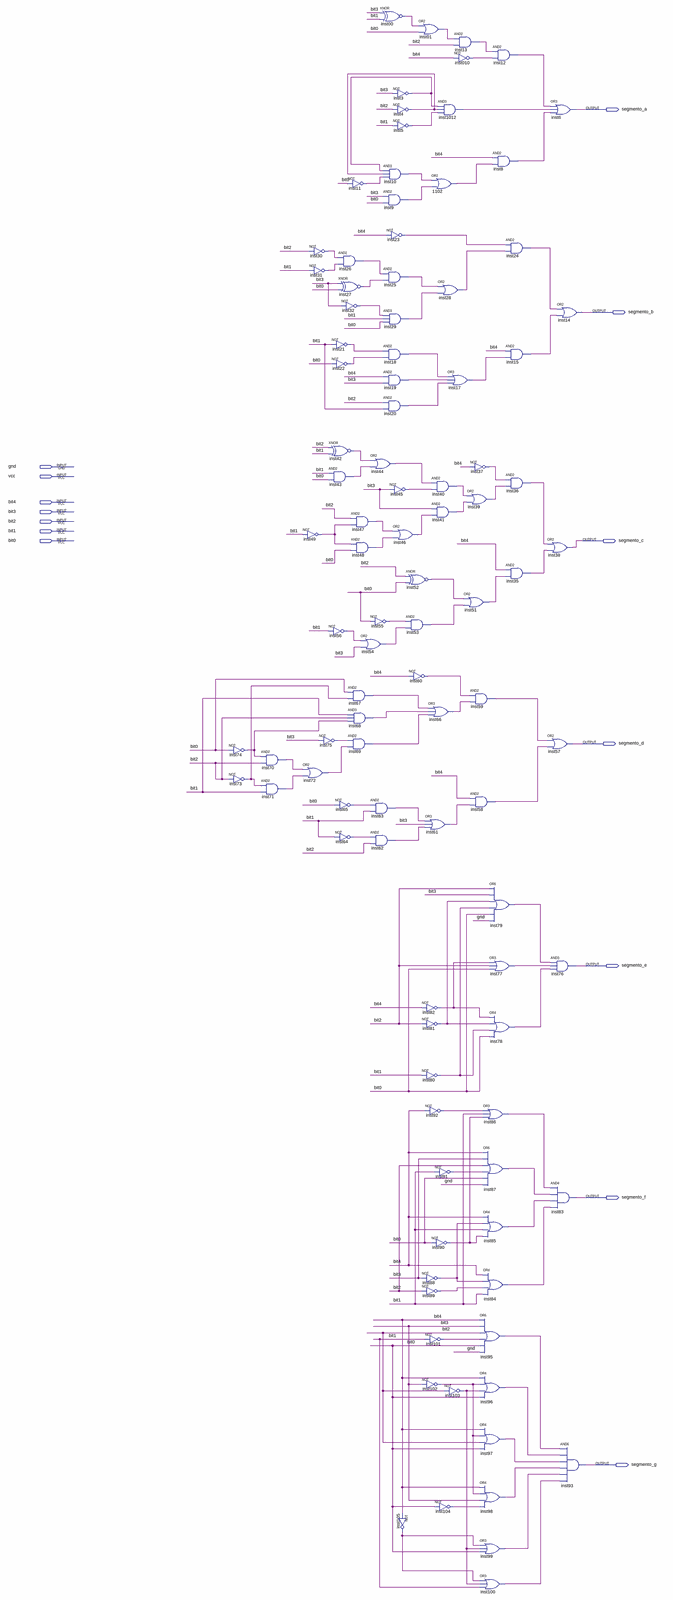
[diagram p0: schematic sheet, whole]
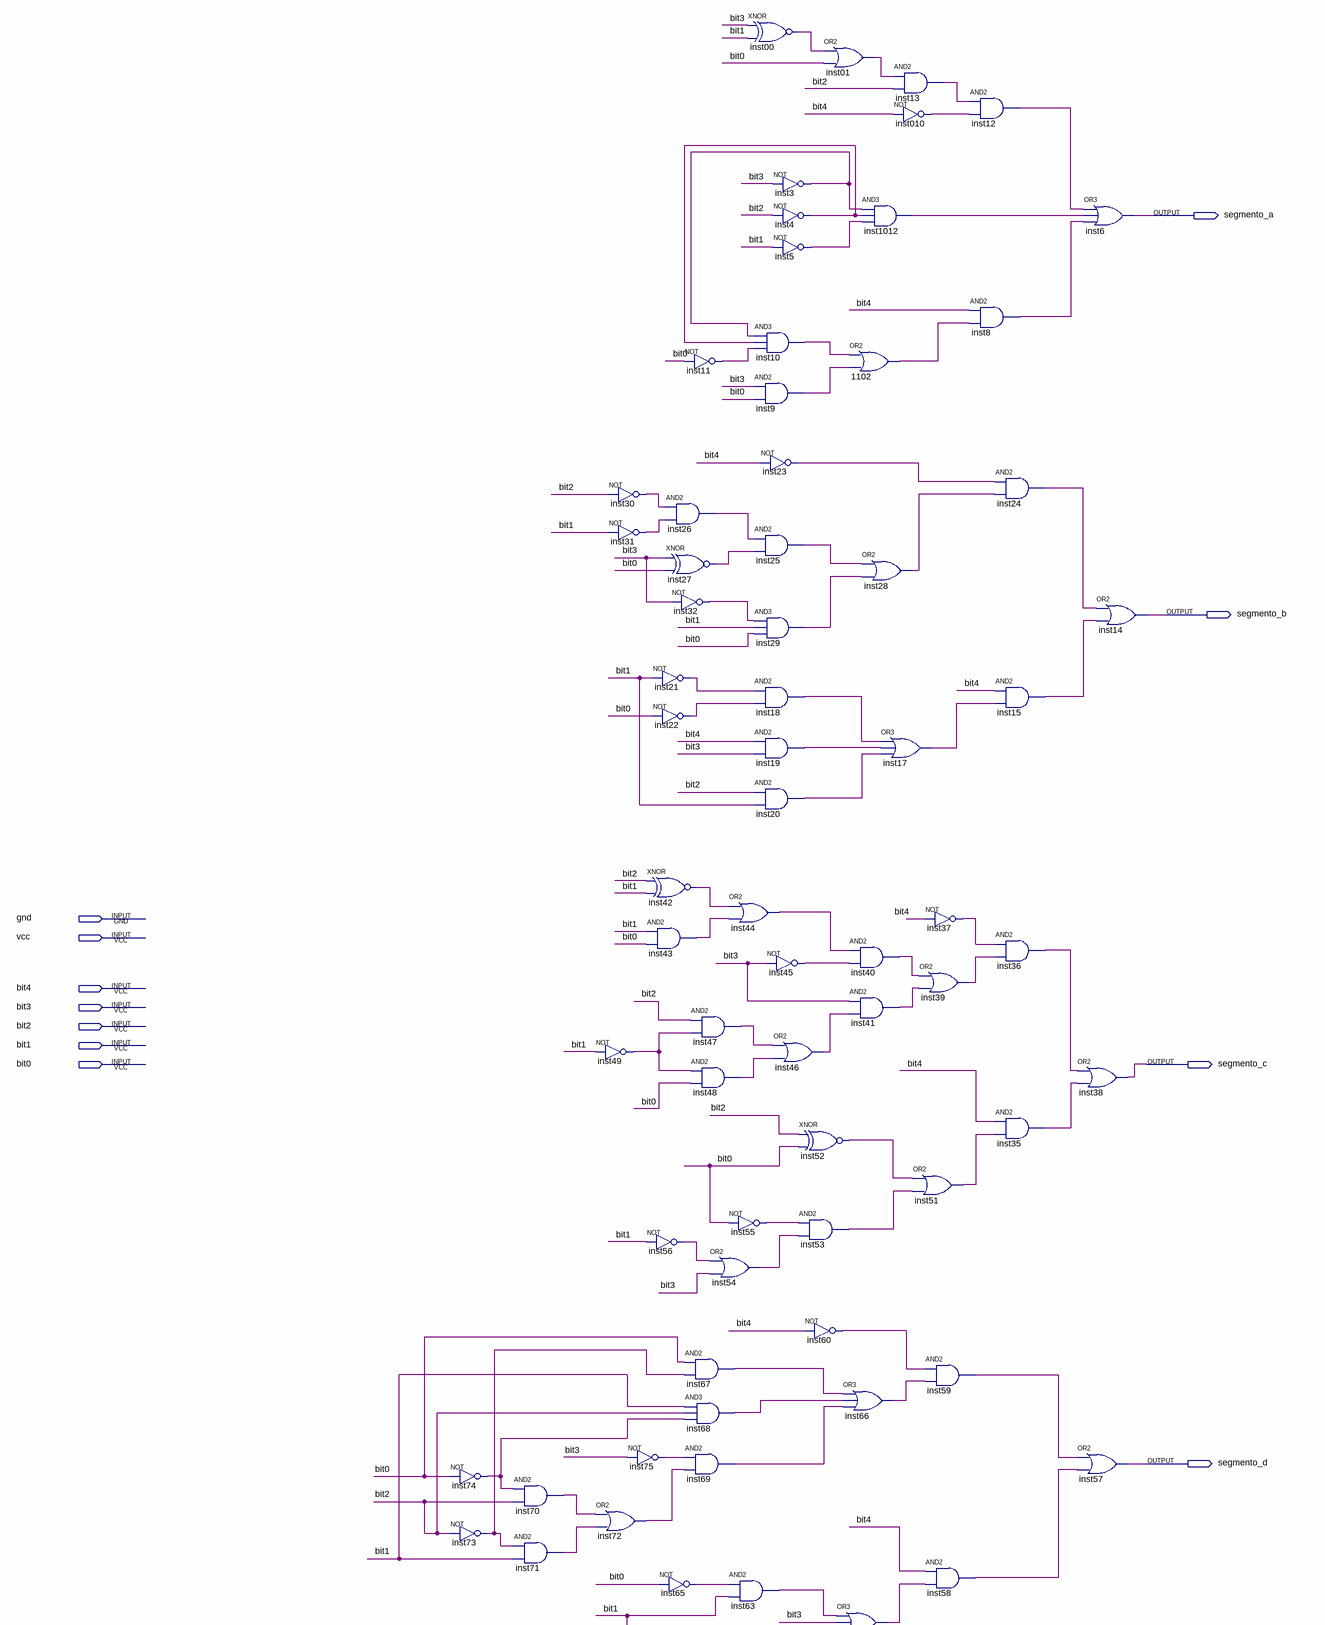
[diagram p1: schematic sheet, upper part]
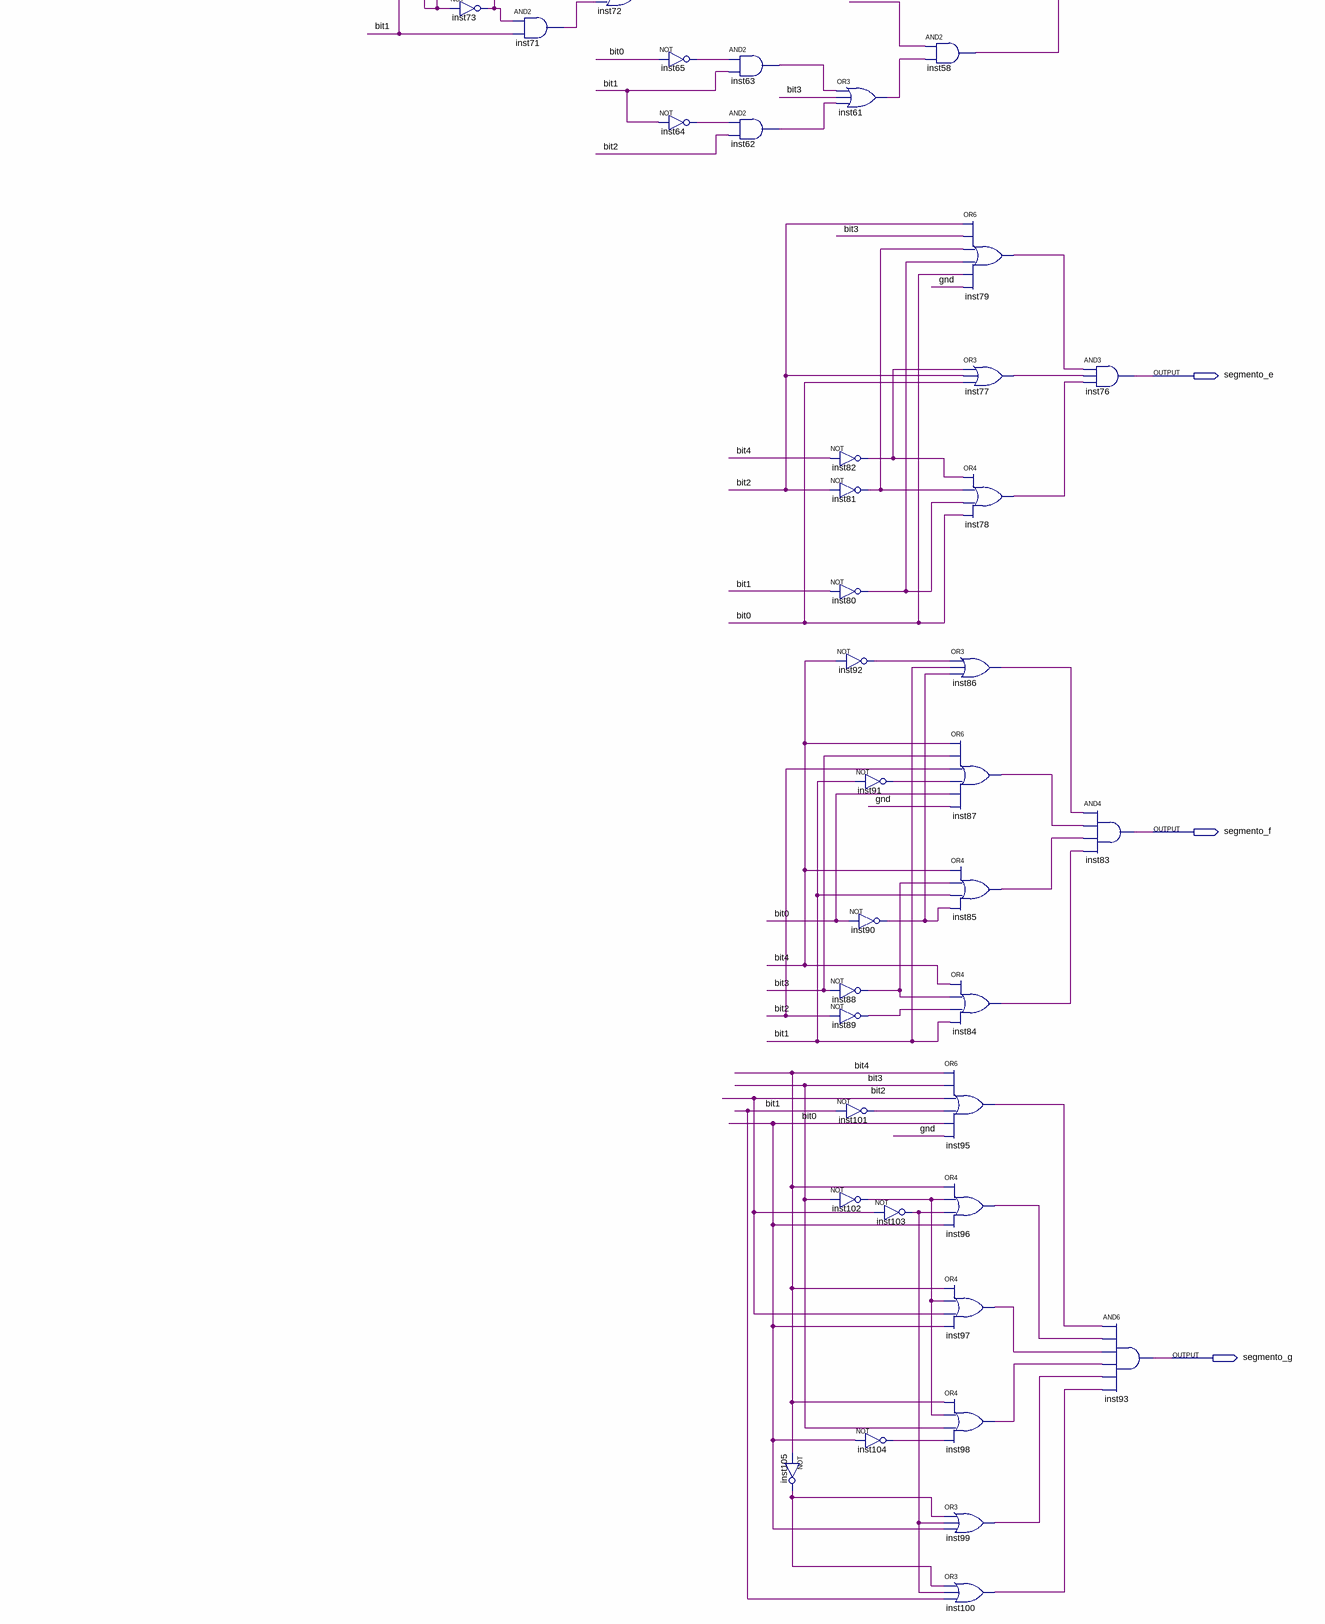
[diagram p2: schematic sheet, lower part]
// Quartus schematic secuencia_7_segmentos.bdf as structural Verilog: 102 symbols, 14 pins
module secuencia_7_segmentos (
  input  gnd,
  input  vcc,
  input  bit4,
  input  bit3,
  input  bit2,
  input  bit1,
  input  bit0,
  output segmento_a,
  output segmento_b,
  output segmento_c,
  output segmento_d,
  output segmento_e,
  output segmento_f,
  output segmento_g
);

  wire inst00_out, inst01_out, inst3_out, inst4_out, inst5_out, inst8_out, inst9_out, inst10_out,
       inst010_out, inst11_out, inst12_out, inst13_out, inst15_out, inst17_out, inst18_out, inst19_out,
       inst20_out, inst21_out, inst22_out, inst23_out, inst24_out, inst25_out, inst26_out, inst27_out,
       inst28_out, inst29_out, inst30_out, inst31_out, inst32_out, inst35_out, inst36_out, inst37_out,
       inst39_out, inst40_out, inst41_out, inst42_out, inst43_out, inst44_out, inst45_out, inst46_out,
       inst47_out, inst48_out, inst49_out, inst51_out, inst52_out, inst53_out, inst54_out, inst55_out,
       inst56_out, inst58_out, inst59_out, inst60_out, inst61_out, inst62_out, inst63_out, inst64_out,
       inst65_out, inst66_out, inst67_out, inst68_out, inst69_out, inst70_out, inst71_out, inst72_out,
       inst73_out, inst74_out, inst75_out, inst77_out, inst78_out, inst79_out, inst80_out, inst81_out,
       inst82_out, inst84_out, inst85_out, inst86_out, inst87_out, inst88_out, inst89_out, inst90_out,
       inst91_out, inst92_out, inst95_out, inst96_out, inst97_out, inst98_out, inst99_out, inst100_out,
       inst101_out, inst102_out, inst103_out, inst104_out, inst105_out, inst1012_out, n1102_out;

  not inst74 (inst74_out, bit0);
  not inst73 (inst73_out, bit2);
  and inst70 (inst70_out, inst74_out, bit2);
  and inst71 (inst71_out, inst73_out, bit1);
  not inst30 (inst30_out, bit2);
  not inst31 (inst31_out, bit1);
  not inst49 (inst49_out, bit1);
  not inst75 (inst75_out, bit3);
  or inst72 (inst72_out, inst70_out, inst71_out);
  not inst11 (inst11_out, bit0);
  and inst26 (inst26_out, inst30_out, inst31_out);
  xnor inst27 (inst27_out, bit3, bit0);
  not inst32 (inst32_out, bit3);
  not inst21 (inst21_out, bit1);
  not inst22 (inst22_out, bit0);
  xnor inst42 (inst42_out, bit2, bit1);
  and inst43 (inst43_out, bit1, bit0);
  and inst47 (inst47_out, bit2, inst49_out);
  and inst48 (inst48_out, inst49_out, bit0);
  not inst56 (inst56_out, bit1);
  and inst67 (inst67_out, bit0, inst73_out);
  and inst68 (inst68_out, bit1, bit2, inst74_out);
  and inst69 (inst69_out, inst75_out, inst72_out);
  not inst65 (inst65_out, bit0);
  not inst64 (inst64_out, bit1);
  or inst44 (inst44_out, inst42_out, inst43_out);
  not inst55 (inst55_out, bit0);
  or inst54 (inst54_out, inst56_out, bit3);
  and inst63 (inst63_out, inst65_out, bit1);
  and inst62 (inst62_out, inst64_out, bit2);
  xnor inst00 (inst00_out, bit3, bit1);
  not inst3 (inst3_out, bit3);
  not inst4 (inst4_out, bit2);
  not inst5 (inst5_out, bit1);
  and inst10 (inst10_out, inst3_out, inst4_out, inst11_out);
  and inst9 (inst9_out, bit3, bit0);
  not inst23 (inst23_out, bit4);
  and inst25 (inst25_out, inst26_out, inst27_out);
  and inst29 (inst29_out, inst32_out, bit1, bit0);
  and inst18 (inst18_out, inst21_out, inst22_out);
  and inst19 (inst19_out, bit4, bit3);
  and inst20 (inst20_out, bit2, bit1);
  not inst45 (inst45_out, bit3);
  or inst46 (inst46_out, inst47_out, inst48_out);
  not inst105 (inst105_out, bit4);
  or inst01 (inst01_out, inst00_out, bit0);
  xnor inst52 (inst52_out, bit2, bit0);
  and inst53 (inst53_out, inst55_out, inst54_out);
  not inst60 (inst60_out, bit4);
  or inst66 (inst66_out, inst67_out, inst68_out, inst69_out);
  or inst61 (inst61_out, inst63_out, bit3, inst62_out);
  not inst82 (inst82_out, bit4);
  not inst81 (inst81_out, bit2);
  not inst80 (inst80_out, bit1);
  not inst92 (inst92_out, bit4);
  not inst88 (inst88_out, bit3);
  not inst89 (inst89_out, bit2);
  not inst101 (inst101_out, bit1);
  not inst102 (inst102_out, bit3);
  and inst13 (inst13_out, inst01_out, bit2);
  not inst010 (inst010_out, bit4);
  and inst1012 (inst1012_out, inst3_out, inst4_out, inst5_out);
  or u_1102 (n1102_out, inst10_out, inst9_out);
  or inst28 (inst28_out, inst25_out, inst29_out);
  or inst17 (inst17_out, inst18_out, inst19_out, inst20_out);
  and inst40 (inst40_out, inst44_out, inst45_out);
  and inst41 (inst41_out, bit3, inst46_out);
  not inst91 (inst91_out, bit1);
  not inst90 (inst90_out, bit0);
  not inst103 (inst103_out, bit2);
  not inst104 (inst104_out, bit0);
  not inst37 (inst37_out, bit4);
  or inst39 (inst39_out, inst40_out, inst41_out);
  or inst51 (inst51_out, inst52_out, inst53_out);
  and inst59 (inst59_out, inst60_out, inst66_out);
  and inst58 (inst58_out, bit4, inst61_out);
  or inst95 (inst95_out, bit4, bit3, bit2, inst101_out, bit0, gnd);
  or inst96 (inst96_out, bit4, inst102_out, inst103_out, bit0);
  or inst97 (inst97_out, bit4, inst102_out, bit2, bit0);
  or inst98 (inst98_out, bit4, inst102_out, bit3, inst104_out);
  or inst99 (inst99_out, inst105_out, inst103_out, bit0);
  or inst100 (inst100_out, inst105_out, inst103_out, bit1);
  and inst12 (inst12_out, inst13_out, inst010_out);
  and inst8 (inst8_out, bit4, n1102_out);
  and inst24 (inst24_out, inst23_out, inst28_out);
  and inst15 (inst15_out, bit4, inst17_out);
  and inst36 (inst36_out, inst37_out, inst39_out);
  and inst35 (inst35_out, bit4, inst51_out);
  or inst79 (inst79_out, bit2, bit3, inst81_out, inst80_out, bit0, gnd);
  or inst77 (inst77_out, inst82_out, bit2, bit0);
  or inst78 (inst78_out, inst82_out, inst81_out, inst80_out, bit0);
  or inst86 (inst86_out, inst92_out, bit1, inst90_out);
  or inst87 (inst87_out, bit4, bit3, bit2, inst91_out, bit0, gnd);
  or inst85 (inst85_out, bit4, inst88_out, bit1, inst90_out);
  or inst84 (inst84_out, bit4, inst88_out, inst89_out, bit1);
  or inst6 (segmento_a, inst12_out, inst1012_out, inst8_out);
  or inst14 (segmento_b, inst24_out, inst15_out);
  or inst38 (segmento_c, inst36_out, inst35_out);
  or inst57 (segmento_d, inst59_out, inst58_out);
  and inst76 (segmento_e, inst79_out, inst77_out, inst78_out);
  and inst83 (segmento_f, inst86_out, inst87_out, inst85_out, inst84_out);
  and inst93 (segmento_g, inst95_out, inst96_out, inst97_out, inst98_out, inst99_out, inst100_out);
endmodule
